# EAGLE design IrrigationManager (EAGLE 9.6.1)
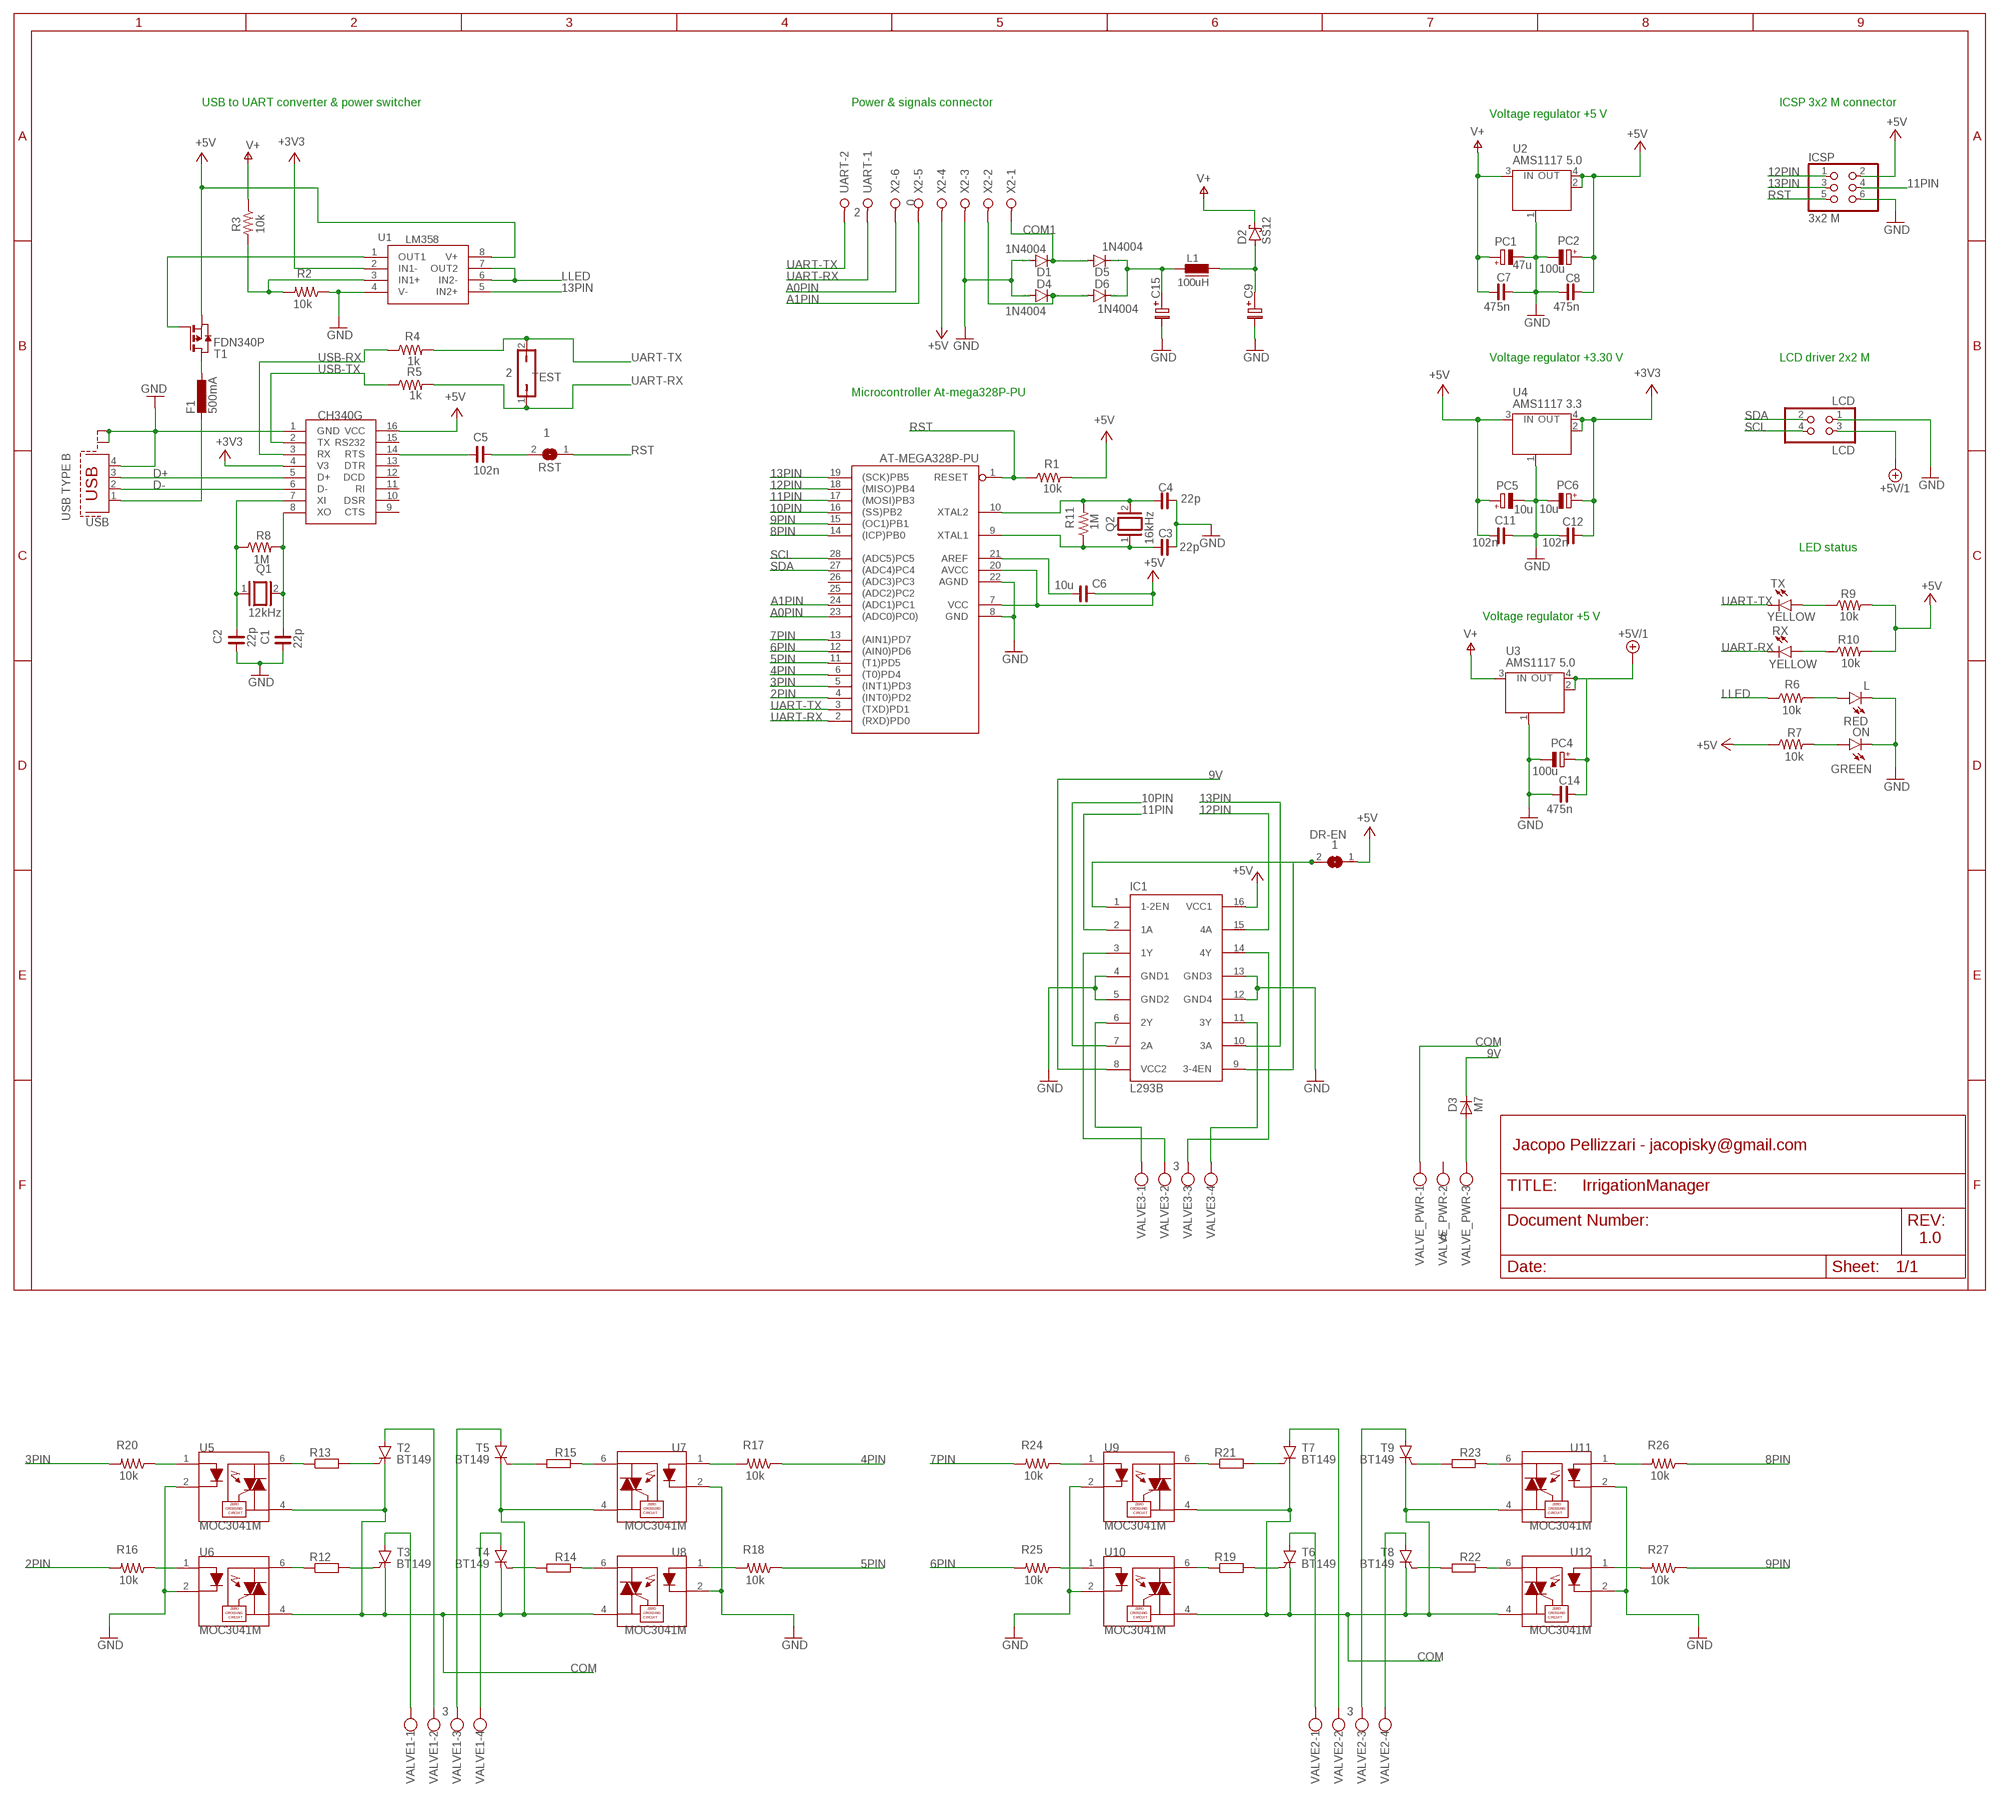
[diagram p0: schematic, sheet 1]

## Parts
AT-MEGA328P-PU  ATMEGA328P-PU  [DIL28-3]
C1  22p  C_1206  [C1206]
C2  22p  C_1206  [C1206]
C3  22p  C_1206  [C1206]
C4  22p  C_1206  [C1206]
C5  102n  C_1206  [C1206]
C6  10u  C_1206  [C1206]
C7  475n  C_1206  [C1206]
C8  475n  C_1206  [C1206]
C9  C-PR-5,0X10  [E5,0-10]
C11  102n  C_1206  [C1206]
C12  102n  C_1206  [C1206]
C14  475n  C_1206  [C1206]
C15  C-PR-5,0X10  [E5,0-10]
D1  1N4004  [DO41-10]
D2  SS12  [SMA]
D3  M7  DIODE-SMB  [SMB]
D4  1N4004  [DO41-10]
D5  1N4004  [DO41-10]
D6  1N4004  [DO41-10]
DR-EN  1  SJ  [SJ]
F1  500mA  L-EUL1812  [L1812]
IC1  L293B  L293D  [DIL16]
ICSP  3x2 M  PINHD-2X3  [2X03]
L  RED  LEDCHIPLED_1206  [CHIPLED_1206]
L1  100uH  07HCP-4U7  [FASTRON_07HCP_INDUCTOR]
LCD  LCD  PINHD-2X2  [2X02]
ON  GREEN  LEDCHIPLED_1206  [CHIPLED_1206]
PC1  47u  CPOL-EUD  [PANASONIC_D]
PC2  100u  CPOL-EUD  [PANASONIC_D]
PC4  100u  CPOL-EUD  [PANASONIC_D]
PC5  10u  CPOL-EU153CLV-0405  [153CLV-0405]
PC6  10u  CPOL-EU153CLV-0405  [153CLV-0405]
Q1  12kHz  XTAL/S  [QS]
Q2  16kHz  XTAL/S  [QS]
R1  10k  ERJ-8GEY0R00V  [RES_1206]
R2  10k  ERJ-8GEY0R00V  [RES_1206]
R3  10k  ERJ-8GEY0R00V  [RES_1206]
R4  1k  ERJ-8GEY0R00V  [RES_1206]
R5  1k  ERJ-8GEY0R00V  [RES_1206]
R6  10k  ERJ-8GEY0R00V  [RES_1206]
R7  10k  ERJ-8GEY0R00V  [RES_1206]
R8  1M  ERJ-8GEY0R00V  [RES_1206]
R9  10k  ERJ-8GEY0R00V  [RES_1206]
R10  10k  ERJ-8GEY0R00V  [RES_1206]
R11  1M  ERJ-8GEY0R00V  [RES_1206]
R12  R-EU_0204/7  [0204/7]
R13  R-EU_0204/7  [0204/7]
R14  R-EU_0204/7  [0204/7]
R15  R-EU_0204/7  [0204/7]
R16  10k  ERJ-8GEY0R00V  [RES_1206]
R17  10k  ERJ-8GEY0R00V  [RES_1206]
R18  10k  ERJ-8GEY0R00V  [RES_1206]
R19  R-EU_0204/7  [0204/7]
R20  10k  ERJ-8GEY0R00V  [RES_1206]
R21  R-EU_0204/7  [0204/7]
R22  R-EU_0204/7  [0204/7]
R23  R-EU_0204/7  [0204/7]
R24  10k  ERJ-8GEY0R00V  [RES_1206]
R25  10k  ERJ-8GEY0R00V  [RES_1206]
R26  10k  ERJ-8GEY0R00V  [RES_1206]
R27  10k  ERJ-8GEY0R00V  [RES_1206]
RST  1  SJ  [SJ]
RX  YELLOW  LEDCHIPLED_1206  [CHIPLED_1206]
T1  FDN340P  PMOSSOT23  [SOT-23]
T2  BT149  [TO92-4]
T3  BT149  [TO92-4]
T4  BT149  [TO92-4]
T5  BT149  [TO92-4]
T6  BT149  [TO92-4]
T7  BT149  [TO92-4]
T8  BT149  [TO92-4]
T9  BT149  [TO92-4]
TEST  2  JP1Q  [JP1]
TX  YELLOW  LEDCHIPLED_1206  [CHIPLED_1206]
U1  LM358  LM358DR  [LM358DR]
U2  AMS1117 5.0  MC33269ST-3.3T3  [SOT223]
U3  AMS1117 5.0  MC33269ST-3.3T3  [SOT223]
U4  AMS1117 3.3  MC33269ST-3.3T3  [SOT223]
U5  MOC3041M  [DIP762W46P254L889H508Q6]
U6  MOC3041M  [DIP762W46P254L889H508Q6]
U7  MOC3041M  [DIP762W46P254L889H508Q6]
U8  MOC3041M  [DIP762W46P254L889H508Q6]
U9  MOC3041M  [DIP762W46P254L889H508Q6]
U10  MOC3041M  [DIP762W46P254L889H508Q6]
U11  MOC3041M  [DIP762W46P254L889H508Q6]
U12  MOC3041M  [DIP762W46P254L889H508Q6]
U$1  CH340G  [SOIC16]
UART  2  W237-02P  [W237-132]
USB  USB TYPE B  PN61729-S  [PN61729-S]
VALVE1  3  W237-04P  [W237-4P]
VALVE2  3  W237-04P  [W237-4P]
VALVE3  3  W237-04P  [W237-4P]
VALVE_PWR  6  W237-03P  [W237-133]
X2  0  W237-06P  [W237-6P]

## Nets
2PIN: AT-MEGA328P-PU.4((INT0)PD2) R16.2
3PIN: AT-MEGA328P-PU.5((INT1)PD3) R20.2
4PIN: AT-MEGA328P-PU.6((T0)PD4) R17.1
5PIN: AT-MEGA328P-PU.11((T1)PD5) R18.1
5VP: T1.3(G) U1.1(OUT1)
6PIN: AT-MEGA328P-PU.12((AIN0)PD6) R25.2
7PIN: AT-MEGA328P-PU.13((AIN1)PD7) R24.2
8PIN: AT-MEGA328P-PU.14((ICP)PB0) R26.1
9PIN: AT-MEGA328P-PU.15((OC1)PB1) R27.1
9V: D3.C IC1.8(VCC2)
10PIN: AT-MEGA328P-PU.16((SS)PB2) IC1.7(2A)
11PIN: AT-MEGA328P-PU.17((MOSI)PB3) IC1.2(1A) ICSP.4
12PIN: AT-MEGA328P-PU.18((MISO)PB4) IC1.15(4A) ICSP.1
13PIN: AT-MEGA328P-PU.19((SCK)PB5) IC1.10(3A) ICSP.3 U1.5(IN2+)
+3V3: C12.2 PC6.+ U1.2(IN1-) U4.2(OUT) U4.4(OUT) U$1.4(V3)
+5V: AT-MEGA328P-PU.7(VCC) AT-MEGA328P-PU.20(AVCC) C6.2 C8.2 C11.1 DR-EN.1 IC1.16(VCC1) ICSP.2 PC2.+ PC5.+ R1.2 R7.1 R9.2 R10.2 T1.2(S) U1.8(V+) U2.2(OUT) U2.4(OUT) U4.3(IN) U$1.16(VCC) X2.4
+5V/1: C14.2 LCD.3 PC4.+ U3.2(OUT) U3.4(OUT)
A0PIN: AT-MEGA328P-PU.23((ADC0)PC0)) X2.6
A1PIN: AT-MEGA328P-PU.24((ADC1)PC1) X2.5
COM: T2.C T3.C T4.C T5.C T6.C T7.C T8.C T9.C U5.4(MT1) U6.4(MT1) U7.4(MT1) U8.4(MT1) U9.4(MT1) U10.4(MT1) U11.4(MT1) U12.4(MT1) VALVE_PWR.1
COM1: D1.C D5.A X2.1
CRST: C5.1 U$1.14(RTS)
D+: U$1.5(D+) USB.3
D-: U$1.6(D-) USB.2
FUSE5V: F1.1 T1.1(D)
GND: AT-MEGA328P-PU.8(GND) AT-MEGA328P-PU.22(AGND) C1.1 C2.1 C3.2 C4.2 C7.2 C8.1 C9.- C11.2 C12.1 C14.1 C15.- D1.A D4.A IC1.4(GND1) IC1.5(GND2) IC1.12(GND4) IC1.13(GND3) ICSP.6 L.C LCD.1 ON.C PC1.- PC2.- PC4.- PC5.- PC6.- R2.1 U1.4(V-) U2.1(GND/ADJ) U3.1(GND/ADJ) U4.1(GND/ADJ) U5.2(C) U6.2(C) U7.2(C) U8.2(C) U9.2(C) U10.2(C) U11.2(C) U12.2(C) U$1.1(GND) USB.4 USB.S1 USB.S2 X2.3
HV10: IC1.6(2Y) VALVE3.1
HV11: IC1.3(1Y) VALVE3.2
HV12: IC1.14(4Y) VALVE3.3
HV13: IC1.11(3Y) VALVE3.4
LLED: R6.1 U1.6(IN2-) U1.7(OUT2)
N$1: D3.A VALVE_PWR.3
N$2: C1.2 Q1.2 R8.2 U$1.8(XO)
N$3: C2.2 Q1.1 R8.1 U$1.7(XI)
N$5: AT-MEGA328P-PU.9(XTAL1) C3.1 Q2.1 R11.1
N$6: AT-MEGA328P-PU.10(XTAL2) C4.1 Q2.2 R11.2
N$9: R12.2 T3.G
N$11: R12.1 U6.6(MT2)
N$12: R13.1 U5.6(MT2)
N$13: D4.C D6.A X2.2
N$14: R2.2 R3.2 U1.3(IN1+)
N$15: C15.+ D5.C D6.C L1.1
N$16: C5.2 RST.2
N$17: T2.A VALVE1.2
N$18: DR-EN.2 IC1.1(1-2EN) IC1.9(3-4EN)
N$19: C9.+ D2.A L1.2
N$20: T4.A VALVE1.4
N$21: R14.2 T4.G
N$22: R14.1 U8.6(MT2)
N$23: R15.1 U7.6(MT2)
N$25: R13.2 T2.G
N$26: R20.1 U5.1(A)
N$27: R15.2 T5.G
N$28: R16.1 U6.1(A)
N$29: T5.A VALVE1.3
N$30: R9.1 TX.A
N$31: R17.2 U7.1(A)
N$32: R18.2 U8.1(A)
N$33: T3.A VALVE1.1
N$35: T6.A VALVE2.1
N$36: R19.2 T6.G
N$37: R19.1 U10.6(MT2)
N$38: R21.1 U9.6(MT2)
N$40: R21.2 T7.G
N$41: T7.A VALVE2.2
N$42: T8.A VALVE2.4
N$43: R22.2 T8.G
N$44: R22.1 U12.6(MT2)
N$45: R23.1 U11.6(MT2)
N$46: R23.2 T9.G
N$47: T9.A VALVE2.3
N$48: R24.1 U9.1(A)
N$49: R25.1 U10.1(A)
N$50: R26.2 U11.1(A)
N$51: R10.1 RX.A
N$52: R27.2 U12.1(A)
N$54: AT-MEGA328P-PU.21(AREF) C6.1
P13LED: L.A R6.2
PWRLED: ON.A R7.2
RST: AT-MEGA328P-PU.1(RESET) ICSP.5 R1.1 RST.1
SCL: AT-MEGA328P-PU.28((ADC5)PC5) LCD.4
SDA: AT-MEGA328P-PU.27((ADC4)PC4) LCD.2
UART-RX: AT-MEGA328P-PU.2((RXD)PD0) R5.2 RX.C TEST.1 UART.1
UART-TX: AT-MEGA328P-PU.3((TXD)PD1) R4.2 TEST.2 TX.C UART.2
USB5V: F1.2 USB.1
USB-RX: R4.1 U$1.3(RX)
USB-TX: R5.1 U$1.2(TX)
V+: C7.1 D2.C PC1.+ R3.1 U2.3(IN) U3.3(IN)
Unconnected: AT-MEGA328P-PU.25((ADC2)PC2) AT-MEGA328P-PU.26((ADC3)PC3) U$1.9(CTS) U$1.10(DSR) U$1.11(RI) U$1.12(DCD) U$1.13(DTR) U$1.15(RS232) VALVE_PWR.2

## Notes on the sheet
- USB to UART converter & power switcher | Power & signals connector | ICSP 3x2 M connector
- Voltage regulator +5 V
- Voltage regulator +3.30 V | LCD driver 2x2 M
- Microcontroller At-mega328P-PU
- LED status
- Voltage regulator +5 V
- Jacopo Pellizzari - jacopisky@gmail.com
- 1.0

## Library data of the parts
AT-MEGA328P-PU = SmartPrj:ATMEGA328P-: MICROCONTROLLER 4 Kbytes FLASH 128 bytes SRAM 256 bytes EEPROM UART 6-channel 10 bit ADC
C1-C8 C11 C12 C14 = rc-master-smd:C_: NON-POLARIZED CAP
C9 C15 = cap-pan40:C-PR: POLARIZED ELECTROLYTIC/TANTALUM
D1 D4-D6 = diode:1N4004: DIODE general purpose rectifier, 1 A
D2 = Diodes:SS12: DIODE SCHOTTKY 20V 1A SMA Manufacturer's datasheet <https://www.onsemi.com/pub/Collateral/SS19-D.PDF>; CREATED_BY: PCBLayout.com; DIGIKEY_PART_NUMBER: SS12FSCT-ND; MANUFACTURER: ON Semiconductor; MPN: SS12; PACKAGE: SMA (DO-214AC)
D3 = Diode:DIODE-: DIODE
DR-EN RST = jumper:SJ: SMD solder JUMPER
F1 = rcl:L-EU: INDUCTOR, European symbol
IC1 = st-microelectronics:L293D: PUSH-PULL 4 CHANNEL DRIVER; MPN: L293D; OC_FARNELL: 9589619; OC_NEWARK: 56P8249
ICSP = SmartPrj:PINHD-2X3: PIN HEADER
L ON RX TX = led:LED: LED OSRAM: - CHIPLED LG R971, LG N971, LY N971, LG Q971, LY Q971, LO R971, LY R971 LH N974, LH R974 LS Q976, LO Q976, LY Q976 LO Q996 - Hyper CHIPLED LW Q18S LB Q993, LB Q99A, LB R99A - SideLED LS A670, LO A670, LY A670, LG A670, LP A670 LB A673, LV A673, LT A673, LW A673 LH A674 LY A675 LS A676, LA A676, LO A676, LY A676, LW A676 LS A679, LY A679, LG A679 - Hyper Micro SIDELED® LS Y876, LA Y876, LO Y876, LY Y876 LT Y87S - SmartLED LW L88C, LW L88S LB L89C, LB L89S, LG L890 LS L89K, LO L89K, LY L89K LS L896, LA L896, LO L896, LY L896 - TOPLED LS T670, LO T670, LY T670, LG T670, LP T670 LSG T670, LSP T670, LSY T670, LOP T670, LYG T670 LG T671, LOG T671, LSG T671 LB T673, LV T673, LT T673, LW T673 LH T674 LS T676, LA T676, LO T676, LY T676, LB T676, LH T676, LSB T676, LW T676 LB T67C, LV T67C, LT T67C, LS T67K, LO T67K, LY T67K, LW E67C LS E67B, LA E67B, LO E67B, LY E67B, LB E67C, LV E67C, LT E67C LW T67C LS T679, LY T679, LG T679 LS T770, LO T770, LY T770, LG T770, LP T770 LB T773, LV T773, LT T773, LW T773 LH T774 LS E675, LA E675, LY E675, LS T675 LS T776, LA T776, LO T776, LY T776, LB T776 LHGB T686 LT T68C, LB T68C - Hyper Mini TOPLED® LB M676 - Mini TOPLED Santana® LG M470 LS M47K, LO M47K, LY M47K Source: http://www.osram.convergy.de LUXEON: - LUMILED® LXK2-PW12-R00, LXK2-PW12-S00, LXK2-PW14-U00, LXK2-PW14-V00 LXK2-PM12-R00, LXK2-PM12-S00, LXK2-PM14-U00 LXK2-PE12-Q00, LXK2-PE12-R00, LXK2-PE12-S00, LXK2-PE14-T00, LXK2-PE14-U00 LXK2-PB12-K00, LXK2-PB12-L00, LXK2-PB12-M00, LXK2-PB14-N00, LXK2-PB14-P00, LXK2-PB14-Q00 LXK2-PR12-L00, LXK2-PR12-M00, LXK2-PR14-Q00, LXK2-PR14-R00 LXK2-PD12-Q00, LXK2-PD12-R00, LXK2-PD12-S00 LXK2-PH12-R00, LXK2-PH12-S00 LXK2-PL12-P00, LXK2-PL12-Q00, LXK2-PL12-R00 Source: www.luxeon.com KINGBRIGHT: KA-3528ASYC Source: www.kingbright.com
L1 = _fastron_07HCP:07HCP-*: Fastron 07 HCP Series Inductors (Ferrite Core) (1 … 10000)uH, THT vertical assembly, 5 mm grid / 8.3 mm max. diameter / 10 mm max. height RoHS-Compliant Source: www.fastrongroup.co Technologies: 07HCP-… L/uH RDCmax/Ω IN/A Isat/A 1R0 1 0.06 7.5 10 2R2 2.2 0.01 6 8 3R3 3.3 0.013 5 6.3 4R7 4.7 0.018 4 5.4 6R8 6.8 0.025 3.8 6.5 100 10 0.04 2.6 5 220 22 0.055 2.3 3.6 470 47 0.1 1.3 2.5 680 68 0.14 1.1 2.1 820 82 0.16 1 1.9 101 100 0.19 0.9 1.6 121 120 0.22 0.85 1 221 220 0.38 0.64 1.2 331 330 0.7 0.51 0.85 471 470 0.89 0.43 0.8 821 820 1.56 0.36 0.7 102 1000 1.84 0.3 0.5 182 1800 3.3 0.21 0.35 103 10000 24 0.14 0.17 ±10% / ±20% fL = 1 kHz | 0.25 V Author: Dipl.-Ing. FH Rainer Bayer HHN Hochschule Heilbronn, rainer.bayer@hs-heilbronn.de Ingenieurbüro ing-rb, mail@ing-rb.de; FASTRON#: 07HCP-4R7
LCD = SmartPrj:PINHD-2X2: PIN HEADER
PC1 PC2 PC4 = rcl:CPOL-EU: POLARIZED CAPACITOR, European symbol
PC5 PC6 = rcl:CPOL-EU: POLARIZED CAPACITOR, European symbol; SPICEPREFIX: C
Q1 Q2 = special:XTAL/S: CRYSTAL
R1-R11 R16-R18 R20 R24-R27 = Resistor_Capacitor:ERJ-8GEY0R00V: RES SMD 0 OHM JUMPER 1/4W 1206 Manufacturer's datasheet <https://industrial.panasonic.com/ww/products/resistors/chip-resistors/general-purpose-chip-resistors/thick-film-chip-resistors/ERJ8GEY0R00V>; CREATED_BY: PCBLayout.com; DIGIKEY_PART_NUMBER: P0.0ETR-ND; MANUFACTURER: Panasonic Electronic Components; MPN: ERJ-8GEY0R00V; PACKAGE: SMD 1206
R12-R15 R19 R21-R23 = rcl:R-EU_: RESISTOR, European symbol; SPICEPREFIX: R
T1 = zetex:PMOSSOT23: MOS FET; OC_FARNELL: unknown; OC_NEWARK: unknown
T2-T9 = triac:BT149: THYRISTOR
TEST = jumper:JP1Q: JUMPER
U1 = IC:LM358DR: IC OPAMP GP 2 CIRCUIT 8SOIC Manufacturer's datasheet <http://www.ti.com/lit/ds/symlink/lm358.pdf>; CREATED_BY: PCBLayout.com; DIGIKEY_PART_NUMBER: 296-1014-1-ND; MANUFACTURER: Texas Instruments; MPN: LM358DR; PACKAGE: 8-SOIC
U2-U4 = linear:MC33269ST*: Adjustable Output Low Dropout Voltage Regulator 800 mA Source: http://www.onsemi.com/pub/Collateral/MC33269-D.PDF
U5-U12 = MOC3041M:MOC3041M: Triac Output Optocoupler, Zero Cross, Zero Crossing, 7.5 kV, 400 V, DIP, 6 Check prices <https://pricing.snapeda.com/parts/MOC3041M/ON%20Semiconductor/view-part?ref=eda>; AVAILABILITY: Good; DESCRIPTION: Optoisolator Triac Output 4170Vrms 1 Channel 6-DIP; MF: ON Semiconductor; MP: MOC3041M; PACKAGE: PDIP-6 ON Semiconductor; PRICE: None; PURCHASE-URL: https://pricing.snapeda.com/search/part/MOC3041M/?ref=eda
U$1 = ch340g:CH340G
UART = con-wago-508:W237-02P: WAGO SREW CLAMP; OC_FARNELL: unknown; OC_NEWARK: unknown
USB = con-berg:PN61729-S: BERG USB connector; OC_FARNELL: unknown; OC_NEWARK: unknown
VALVE1-VALVE3 = con-wago-508:W237-04P: WAGO SREW CLAMP
VALVE_PWR = con-wago-508:W237-03P: WAGO SREW CLAMP
X2 = con-wago-508:W237-06P: WAGO SREW CLAMP; OC_FARNELL: unknown; OC_NEWARK: unknown

## Board
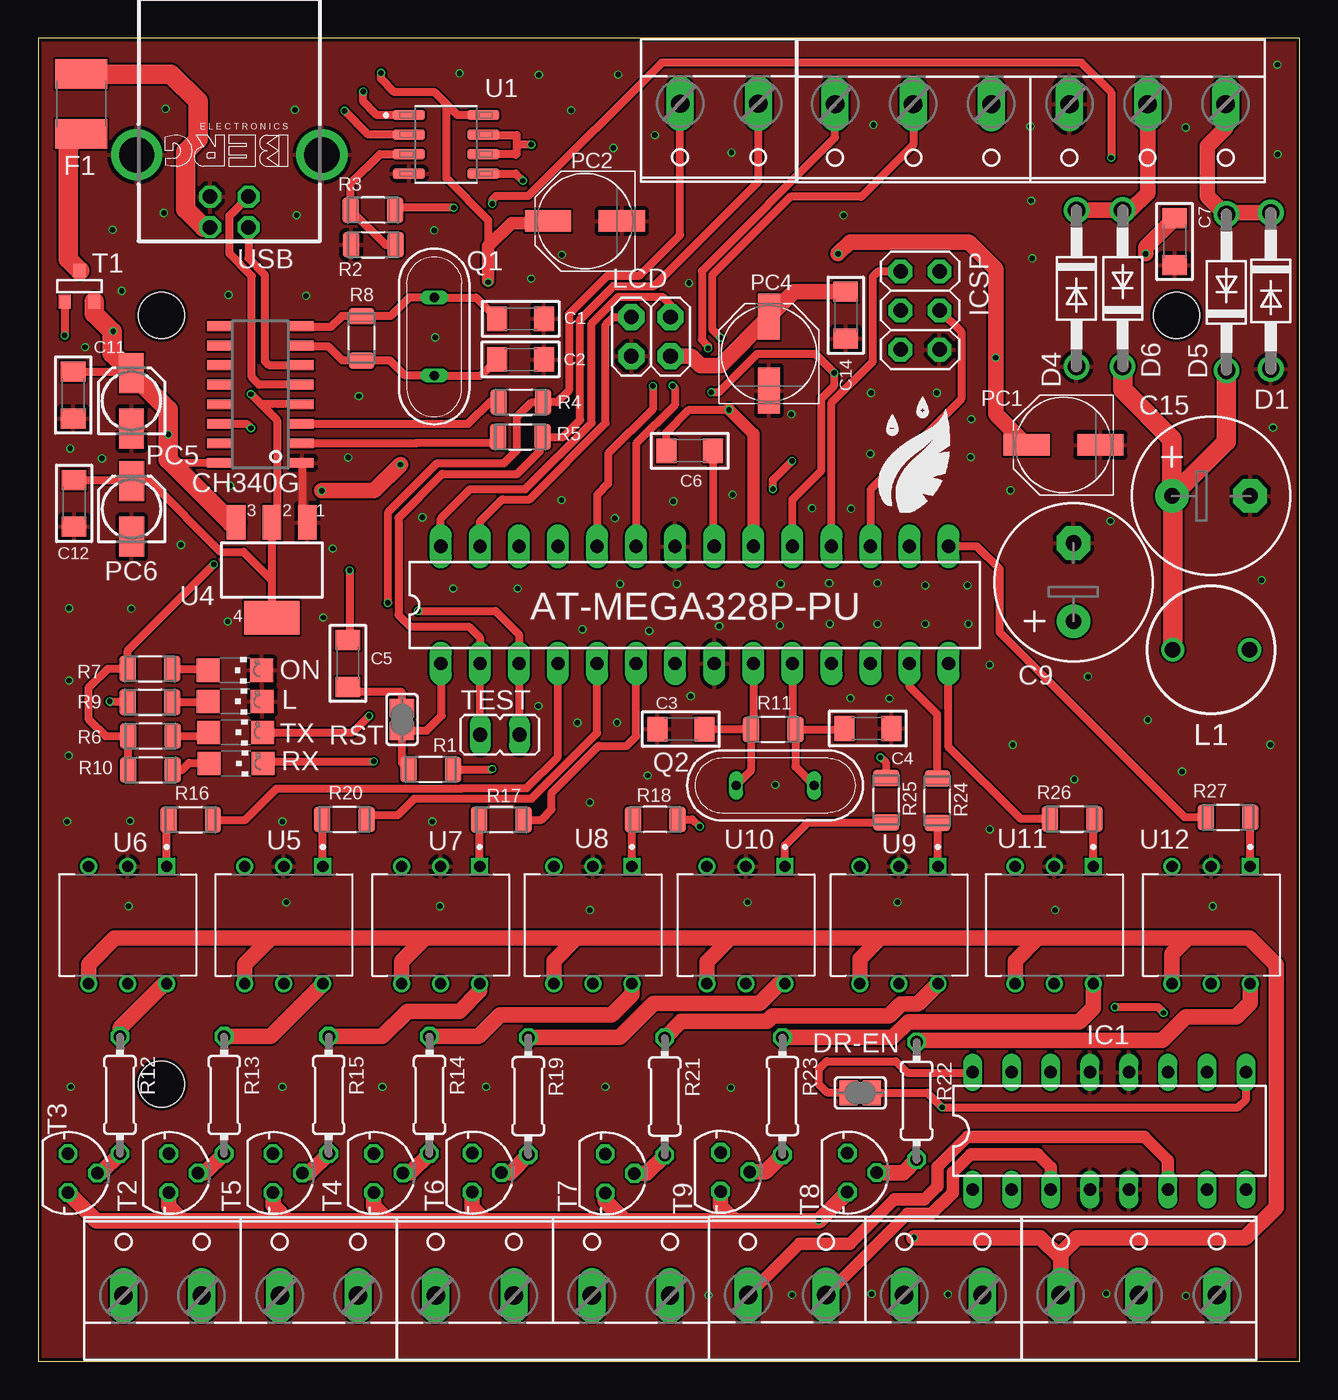
[diagram p1: board, top side]
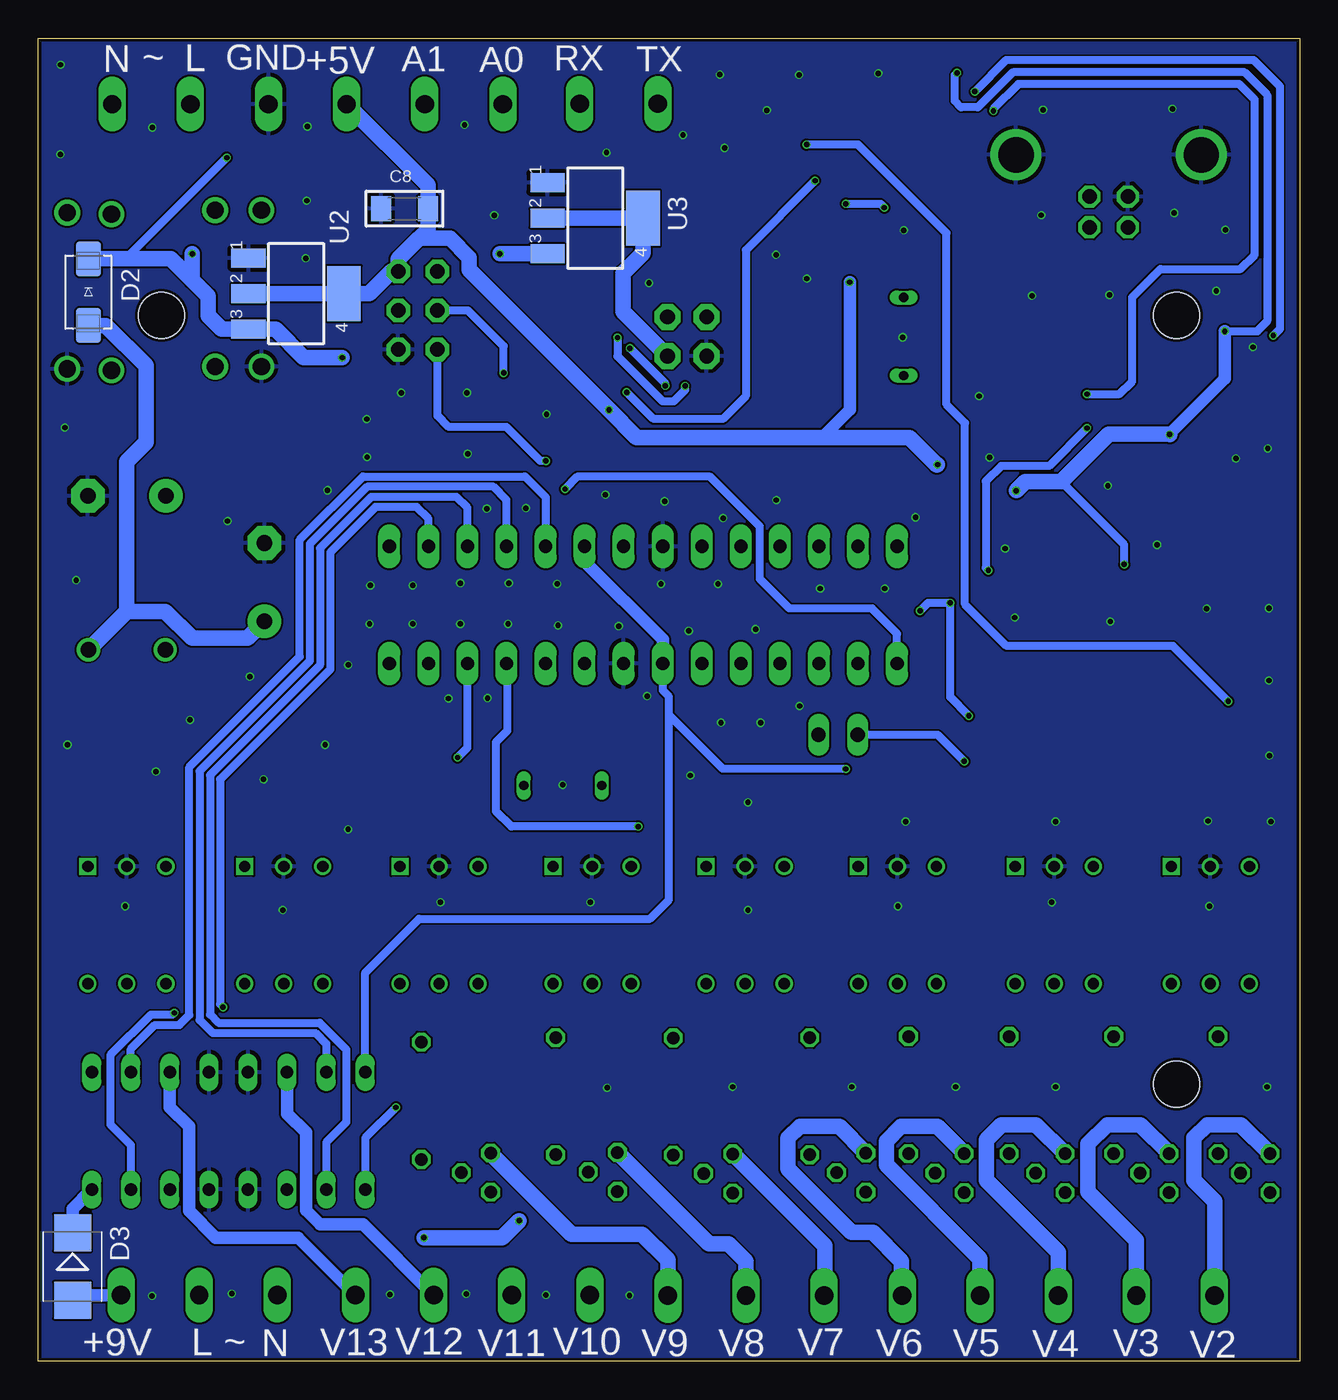
[diagram p2: board, bottom side, seen from below]

Size 82 x 86 mm. Coordinates in mm from the lower left corner, seen from the top.
Outline: 0,0 82,0 82,86 0,86 0,0
Copper layers (1*16): Top 0.035559375mm / dielectric 1.6mm / Bottom 0.035559375mm
Design rules "jlcpcb2layer": minimum track width 5mil, minimum drill 12mil, track to track 5mil, track to pad 5mil, pad to pad 5mil, via to via 5mil, smd to smd 5mil, copper to edge 8mil, drill to drill 6mil, minimum pad ring 5mil, minimum via ring 3mil, stop-mask expansion 2.5mil, vias tented up to drill 0mil, thermal gap 10mil
Holes 3 mm at 8,18 74,68 8,68

### Footprints (pad centres in the part's own frame; a part is rotated, then mirrored left to right if it is on the bottom)
DIL28-3 = drill 0.85 pad 1.422 long: 1 -16.51,-3.81; 2 -13.97,-3.81; 3 -11.43,-3.81; 4 -8.89,-3.81; 5 -6.35,-3.81; 6 -3.81,-3.81; 7 -1.27,-3.81; 8 1.27,-3.81; 9 3.81,-3.81; 10 6.35,-3.81; 11 8.89,-3.81; 12 11.43,-3.81; 13 13.97,-3.81; 14 16.51,-3.81; 15 16.51,3.81; 16 13.97,3.81; 17 11.43,3.81; 18 8.89,3.81; 19 6.35,3.81; 20 3.81,3.81; 21 1.27,3.81; 22 -1.27,3.81; 23 -3.81,3.81; 24 -6.35,3.81; 25 -8.89,3.81; 26 -11.43,3.81; 27 -13.97,3.81; 28 -16.51,3.81
C1206 = smd 1.3 x 1.6: 1 -1.524,0; 2 1.524,0
E5,0-10 = drill 1.016 pad 2.184: + -2.54,0 | drill 1.016 pad 2.184 octagon: - 2.54,0
DO41-10 = drill 1.118: A 5.08,0; C -5.08,0
SMA = smd 2.28 x 1.66: A 2.165,0; C -2.165,0
SMB = smd 2.4 x 2.4: A 2.2,0; C -2.2,0
SJ = smd 1.168 x 1.6: 1 -0.762,0; 2 0.762,0
L1812 = smd 1.9 x 3.4: 1 -1.95,0; 2 1.95,0
DIL16 = drill 0.813 long: 1 -8.89,-3.81; 2 -6.35,-3.81; 3 -3.81,-3.81; 4 -1.27,-3.81; 5 1.27,-3.81; 6 3.81,-3.81; 7 6.35,-3.81; 8 8.89,-3.81; 9 8.89,3.81; 10 6.35,3.81; 11 3.81,3.81; 12 1.27,3.81; 13 -1.27,3.81; 14 -3.81,3.81; 15 -6.35,3.81; 16 -8.89,3.81
2X03 = drill 0.95 pad 1.55 octagon: 1 -2.54,-1.27; 2 -2.54,1.27; 3 0,-1.27; 4 0,1.27; 5 2.54,-1.27; 6 2.54,1.27
CHIPLED_1206 = smd 1.5 x 1.5: A 0,-1.75; C 0,1.75
FASTRON_07HCP_INDUCTOR = drill 1: 1 -2.5,0; 2 2.5,0
2X02 = drill 0.95 pad 1.676 octagon: 1 -1.27,-1.27; 2 -1.27,1.27; 3 1.27,-1.27; 4 1.27,1.27
PANASONIC_D = smd 3 x 1.4: + 2.4,0; - -2.4,0
153CLV-0405 = smd 2.6 x 1.6: + 1.8,0; - -1.8,0
QS = drill 0.61 long: 1 -2.54,0; 2 2.54,0
RES_1206 = smd 1.08 x 1.68: 1 -1.445,0; 2 1.445,0
0204/7 = drill 0.813 octagon: 1 -3.81,0; 2 3.81,0
SOT-23 = smd 0.787 x 0.889: 1 0.025,-1.016; 2 -0.94,1.016; 3 0.991,1.016
TO92-4 = drill 0.813 octagon: A -1.27,0; C 1.27,0; G 0,1.905
JP1 = drill 0.914 long: 1 0,-1.27; 2 0,1.27
LM358DR = smd 0.66 x 2.07: 1 -1.905,-2.42; 2 -0.635,-2.42; 3 0.635,-2.42; 4 1.905,-2.42; 5 1.905,2.42; 6 0.635,2.42; 7 -0.635,2.42; 8 -1.905,2.42
SOT223 = smd 1.219 x 2.235: 1 -2.311,-3.099; 2 0,-3.099; 3 2.311,-3.099 | smd 3.6 x 2.2: 4 0,3.099
DIP762W46P254L889H508Q6 = drill 0.74 square: 1 -3.81,2.54 | drill 0.74: 2 -3.81,0; 3 -3.81,-2.54; 4 3.81,-2.54; 5 3.81,0; 6 3.81,2.54
SOIC16 = smd 0.635 x 1.524: 1 -4.445,-2.695; 2 -3.175,-2.695; 3 -1.905,-2.695; 4 -0.635,-2.695; 5 0.635,-2.695; 6 1.905,-2.695; 7 3.175,-2.695; 8 4.445,-2.695; 9 4.445,2.695; 10 3.175,2.695; 11 1.905,2.695; 12 0.635,2.695; 13 -0.635,2.695; 14 -1.905,2.695; 15 -3.175,2.695; 16 -4.445,2.695
W237-132 = drill 1.194 long: 1 -2.54,-0.635; 2 2.54,-0.635
PN61729-S = drill 0.95 octagon: 1 1.25,4.71; 2 -1.25,4.71; 3 -1.25,2.71; 4 1.25,2.71 | drill 2.3 pad 2.9: S1 -6.02,0; S2 6.02,0
W237-4P = drill 1.194 long: 1 -7.62,-0.635; 2 -2.54,-0.635; 3 2.54,-0.635; 4 7.62,-0.635
W237-133 = drill 1.194 long: 1 -5.08,-0.635; 2 0,-0.635; 3 5.08,-0.635
W237-6P = drill 1.194 long: 1 -12.7,-0.635; 2 -7.62,-0.635; 3 -2.54,-0.635; 4 2.54,-0.635; 5 7.62,-0.635; 6 12.7,-0.635

### Placement (x,y rotation side)
AT-MEGA328P-PU  42.67,49.17 0 top
C1  31.36,67.77 180 top
C2  31.35,65.13 180 top
C3  41.78,41.09 180 top
C4  53.93,41.13 0 top
C5  20.12,45.36 270 top
C6  42.35,59.19 180 top
C7  73.88,72.79 270 top
C8  58.2,74.93 0 bottom
C9  67.3,50.65 90 top
C11  2.26,62.82 270 top
C12  2.32,55.77 90 top
C14  52.5,68 90 top
C15  76.25,56.25 0 top
D1  80.13,69.59 270 top
D2  78.75,69.5 270 bottom
D3  79.78,6.15 270 bottom
D4  67.5,69.75 270 top
D5  77.25,69.5 90 top
D6  70.5,69.75 90 top
DR-EN  53.44,17.44 0 top
F1  2.78,81.74 90 top
IC1  69.64,14.96 0 top
ICSP  57.33,68.32 270 top
L  12.79,42.9 270 top
L1  76.25,46.25 0 top
LCD  39.83,66.62 0 top
ON  12.78,44.92 270 top
PC1  66.65,59.57 180 top
PC2  35.53,74.12 180 top
PC4  47.5,65.5 90 top
PC5  6.06,62.43 90 top
PC6  6.07,55.4 90 top
Q1  25.73,66.62 90 top
Q2  47.9,37.43 0 top
R1  25.51,38.47 0 top
R2  21.76,72.59 0 top
R3  21.76,74.84 180 top
R4  31.36,62.34 0 top
R5  31.34,60.09 0 top
R6  7.26,42.84 0 top
R7  7.26,45.01 0 top
R8  21.01,66.51 90 top
R9  7.29,40.64 180 top
R10  7.29,38.43 180 top
R11  47.77,41.07 0 top
R12  5.3,17.3 270 top
R13  12.07,17.3 270 top
R14  25.43,17.3 270 top
R15  18.88,17.3 270 top
R16  9.9,35.2 0 top
R17  30.1,35.2 180 top
R18  40.1,35.23 180 top
R19  31.85,17.23 270 top
R20  19.9,35.23 0 top
R21  40.73,17.2 270 top
R22  57.1,16.93 270 top
R23  48.38,17.23 270 top
R24  58.45,36.42 90 top
R25  55.12,36.48 90 top
R26  67.2,35.25 0 top
R27  77.35,35.35 0 top
RST  23.64,41.72 90 top
RX  12.86,38.86 270 top
T1  2.69,69.9 180 top
T2  8.47,12.22 270 top
T3  1.93,12.22 270 top
T4  21.8,12.22 270 top
T5  15.25,12.22 270 top
T6  28.2,12.25 270 top
T7  36.85,12.2 270 top
T8  52.6,12.25 270 top
T9  44.35,12.3 270 top
TEST  30,40.72 270 top
TX  12.82,40.88 270 top
U1  26.51,79.12 270 top
U2  65.24,69.4 270 bottom
U3  45.8,74.31 270 bottom
U4  15.17,51.43 180 top
U5  15.95,28.35 270 top
U6  5.8,28.35 270 top
U7  26.15,28.35 270 top
U8  36.05,28.35 270 top
U9  55.95,28.35 270 top
U10  46,28.35 270 top
U11  66.05,28.35 270 top
U12  76.25,28.35 270 top
U$1  14.44,62.85 90 top
UART  44.26,81.12 180 top
USB  12.41,78.43 180 top
VALVE1  13.15,4.9 0 top
VALVE2  33.45,4.9 0 top
VALVE3  53.76,4.92 0 top
VALVE_PWR  71.55,4.93 0 top
X2  64.5,81.09 180 top

### Tracks (layer width: path | path; a pad name or v marks a point on that pad's centre or on a via)
2PIN
  Top 0.508: AT-MEGA328P-PU.4 33.78,39.28 31.75,37.25 27.54,37.25 27.51,37.23 15.48,37.23 13.45,35.2 R16.2
3PIN
  Top 0.508: R20.2 21.62,35.5 23.38,35.5 24.44,36.57 32.07,36.57 36.32,40.82 AT-MEGA328P-PU.5
4PIN
  Top 0.508: R17.1 32.7,35.2 33.38,35.88 33.38,36.94 36.43,40 38.25,40 38.86,40.61 AT-MEGA328P-PU.6
5PIN  (via drill 0.35)
  Top 0.508: R18.1 42.52,35.23 v43,34.75
  Bottom 0.508: v43,34.75 51.25,34.75 52.25,35.75 52.25,40.25 51.5,41 51.5,45.29 AT-MEGA328P-PU.11
5VP  (via drill 0.35)
  Top 0.508: T1.3 v1.7,66.68 | U1.1 22,81.02 21.12,81.91 v21.12,82.55
  Bottom 0.508: v1.7,66.68 1.28,67.11 1.28,82.88 2.98,84.58 19.08,84.58 v21.12,82.55
6PIN  (via drill 0.35)
  Top 0.508: R25.2 55.12,38.88 v54.75,39.25
  Bottom 0.508: v54.75,39.25 54.1,39.9 AT-MEGA328P-PU.12
7PIN
  Top 0.508: R24.2 58.45,42.05 56.64,43.86 AT-MEGA328P-PU.13
8PIN
  Top 0.508: R26.1 63.88,35.25 59.18,39.94 AT-MEGA328P-PU.14
9PIN
  Top 0.508: R27.1 74.53,35.35 62.5,47.38 62.5,51.5 61.02,52.98 AT-MEGA328P-PU.15
9V
  Bottom 0.813: D3.C 79.78,9.9 IC1.8
10PIN  (via drill 0.35)
  Top 0.508: v70,23.01 72.79,23.01 v73.16,22.64
  Bottom 0.508: AT-MEGA328P-PU.16 56.64,54.77 57.41,55.53 60.08,55.53 63.03,52.58 63.03,44.98 70.18,37.82 70.18,23.2 v70,23.01 | v73.16,22.64 73.29,22.52 74.7,22.52 77.32,19.9 77.32,15.39 75.99,14.06 IC1.7
11PIN
  Top 0.508: ICSP.4 58.62,68.31 60,66.94 60,62.56 54.1,56.66 AT-MEGA328P-PU.17
  Bottom 0.508: AT-MEGA328P-PU.17 54.1,55.49 54.81,56.19 60.35,56.19 63.69,52.86 63.69,45.25 70.84,38.09 70.84,22.53 70.31,21.99 63.71,21.99 61.98,20.27 61.98,15.53 63.29,14.22 IC1.2
12PIN
  Top 0.508: AT-MEGA328P-PU.18 51.56,62.31 54.25,65 54.25,70.5 54.6,70.86 ICSP.1
  Bottom 0.508: AT-MEGA328P-PU.18 51.56,56 52.42,56.85 60.63,56.85 64.35,53.13 64.35,45.52 71.52,38.35 71.52,22.18 70.67,21.33 63.98,21.33 63.29,20.64 IC1.15
13PIN  (via drill 0.35)
  Top 0.508: AT-MEGA328P-PU.19 49.02,56.02 50.9,57.9 50.9,62.59 51.75,63.43 v51.75,64.25 50.5,65.5 46.75,65.5 44.25,63 v43.75,63 | U1.5 31.04,77.21 v31.5,76.75
  Bottom 0.508: IC1.10 75.99,20.29 74.43,21.86 72.84,21.86 72.19,22.5 72.19,38.62 65.01,45.8 65.01,53.4 60.9,57.52 50.37,57.52 49.02,56.17 AT-MEGA328P-PU.19 | v51.75,64.25 51.75,66 54.06,68.31 ICSP.3 | v31.5,76.75 36,72.25 36,62.75 37.5,61.25 42,61.25 v43.75,63
+3V3  (via drill 0.35)
  Top 0.508: U$1.4 14.48,62.22 v13.82,62.87 15.52,61.17 15.52,54.87 U4.2 15.17,50.79 | 15.17,50.79 U4.4 | C12.2 5.97,57.3 PC6.+ 7.27,57.2 11.86,52.62 13.35,52.62 15.17,50.79 | U1.2 21.45,79.75 v19.9,81.3
  Bottom 0.508: v13.82,62.87 11.71,62.87 10.88,63.7 10.88,69.17 9.04,71 3.83,71 2.92,71.92 2.92,82.02 3.93,83.03 18.29,83.03 19.9,81.42 v19.9,81.3
+5V  (via drill 0.35)
  Top 0.508: U1.8 27.24,81.02 26.55,81.72 | v22.27,83.77 22.27,83.37 23.13,82.51 25.75,82.51 26.55,81.72 | C11.1 5.95,64.34 PC5.+ | 26.55,81.72 26.55,76.92 26.52,76.9 29.25,74.18 29.25,70.25 v29.25,70.15 | U$1.16 8.67,58.41 8.44,58.63 | C6.2 40.83,60.37 42.31,61.85 v44.9,61.85 | R10.2 R9.2 4.36,40.64 3.25,41.75 3.25,43.75 4.51,45.01 R7.1 5.82,46.22 v11.4,51.8 | DR-EN.1 51.31,17.44 50.75,18 50.75,19 51.25,19.5 55.75,19.5 56.5,18.75 60.73,18.75 IC1.16 | R1.2 29.48,38.48 v29.5,38.5
  Top 0.813: v44.9,61.85 46.48,60.27 AT-MEGA328P-PU.20 | PC2.+ 33.01,74 30.75,74 29.25,72.5 29.25,70.25
  Top 1.016: v18.43,56.59 21.83,56.59 v23.54,58.29
  Top 1.27: T1.2 3.63,68.1 4.79,66.94 4.79,65.5 PC5.+ 8.44,61.85 v8.44,60.25 8.44,58.63 12.55,54.53 U4.3
  Bottom 0.508: v4.86,66.96 v4.86,66.97 2.74,66.97 2.1,67.61 2.1,82.33 3.57,83.8 18.64,83.8 20.93,81.52 22,81.52 22.42,81.94 22.42,83.61 v22.27,83.77 | v11.4,51.8 11.4,53.09 15.49,57.18 | IC1.16 60.75,25.25 57.25,28.75 42.25,28.75 41,30 41,42 | AT-MEGA328P-PU.7 41.4,43.61 41,43.2 41,42 | v29.5,38.5 37.5,38.5 41,42
  Bottom 0.813: v29.25,70.15 29.25,61.86 31.05,60.06 | AT-MEGA328P-PU.7 41.4,46.9 46.48,51.98 AT-MEGA328P-PU.20 | v4.86,66.96 4.86,63.87 8.46,60.27
  Bottom 1.016: v23.54,58.29 23.57,58.26 25.38,60.06 31.05,60.06 43.11,60.06 v44.9,61.85 54,70.95 54,71.75 55.25,73 57.25,73 | v18.43,56.59 17.83,57.18 15.49,57.18 12.4,60.27 8.46,60.27 v8.44,60.25 | U2.2 U2.4 60.5,69.4 59.05,70.86 ICSP.2 58.6,71.65 57.25,73 | 57.25,73 56.68,73.57 C8.2 56.68,76.44 X2.4
+5V/1
  Top 1.016: LCD.3 42.45,65.34 43.06,64.73 44.33,64.73 PC4.+ 49.12,69.52 C14.2
  Bottom 1.016: U3.2 U3.4 42.7,72.05 44,70.75 44,68.25 LCD.3
A0PIN  (via drill 0.35)
  Top 0.508: AT-MEGA328P-PU.23 38.86,59.65 41.39,62.17 41.39,63.27 v41.24,63.42 | v43.55,65.85 43.55,66 43.13,66.42 43.13,70.88 51.8,79.55 X2.6
  Bottom 0.508: v43.55,65.85 41.24,63.54 v41.24,63.42
A1PIN  (via drill 0.35)
  Top 0.508: X2.5 56.88,79.08 53.5,75.7 48.88,75.7 43.8,70.62 43.8,67.1 v44.35,66.55 | v39.95,63.4 39.95,61.9 37.05,59 37.05,57.05 36.32,56.32 AT-MEGA328P-PU.24
  Bottom 0.508: v39.95,63.4 39.95,63.15 40.69,62.41 41.42,62.41 44.35,65.34 v44.35,66.55
COM  (via drill 0.35)
  Top 1.016: T3.C 3.75,9.12 9.38,9.12 | T2.C 8.47,10.03 9.38,9.12 | 9.38,9.12 16.25,9.12 | 16.25,9.12 22.75,9.12 | T5.C 15.25,10.12 16.25,9.12 | T4.C 21.8,10.07 22.75,9.12 | U6.4 3.26,25.79 4.97,27.5 15.12,27.5 | 15.12,27.5 25.12,27.5 | 25.12,27.5 35,27.5 | 35,27.5 45,27.5 | 45,27.5 54.75,27.5 | 54.75,27.5 65,27.5 | 65,27.5 74.75,27.5 | 15.12,27.5 13.41,25.79 U5.4 | U7.4 23.61,25.98 25.12,27.5 | U8.4 33.51,26.01 35,27.5 | 22.75,9.12 29.04,9.12 | 29.04,9.12 38.13,9.12 | 38.13,9.12 45.25,9.12 | 45.25,9.12 v50.74,9.12 T8.C | v56.93,8.03 65.16,8.03 66.47,6.71 VALVE_PWR.1 66.47,6.96 67.51,8 78.48,8 80.48,10 80.48,25.75 78.73,27.5 74.75,27.5 | 38.13,9.12 36.85,10.41 T7.C | T6.C 28.2,9.96 29.04,9.12 | T9.C 44.35,10.03 45.25,9.12 | U10.4 43.46,25.96 45,27.5 | U9.4 53.41,26.16 54.75,27.5 | U11.4 63.51,26.01 65,27.5 | U12.4 73.71,26.46 74.75,27.5
  Bottom 1.016: v56.93,8.03 51.84,8.03 v50.74,9.12
COM1
  Top 1.016: D5.A 77.34,74.67 | 77.34,74.67 D1.C | X2.1 77.2,80.2 76,79 76,75.75 77.08,74.67 77.34,74.67
CRST  (via drill 0.35)
  Top 0.508: U$1.14 13.54,60.95 v13.82,60.67 | v20.23,51.41 20.23,46.99 C5.1
  Bottom 0.508: v13.82,60.67 16.27,58.21 19.4,58.21 20.4,57.21 20.4,51.58 v20.23,51.41
D+
  Top 0.508: U$1.5 14.37,63.48 13.87,63.99 13.87,70.56 12.43,72 12.43,74.49 USB.3
D-
  Top 0.508: USB.2 13.66,71.7 14.72,70.64 14.72,65.02 14.98,64.76 U$1.6
FUSE5V
  Top 1.27: F1.1 1.94,78.95 1.94,71.65 T1.1
GND  (via drill 0.35)
  Top 0.508: U$1.1 17.13,54.88 U4.1
  other vias: 40.09,79.72 74.6,80.21 80.57,78.46 80.56,84.29 54.29,80.38 64.51,80.28 72.14,41.69 8.15,74.65 69.43,4.38 74.61,4.23 20.83,62.75 25.8,66.56 8.26,81.42 16.67,81.36 16.79,74.51 2.07,59.34 4.13,58.69 27.39,83.73 47.91,37.46 1.99,48.95 9.26,53.08 12.3,48.09 45.13,56.34 64.62,71.71 79.54,50.77 37.48,54.8 42.3,70.1 37.69,83.65 45.06,78.58 64.56,75.45 34.02,55.98 19.14,52.83 5.41,69.59 52.36,74.5 54.14,62.95 48.96,61.57 45.02,17.77 43.57,4.27 49.01,4.3 54.18,4.37 59.14,4.33 4.82,73.56 3.03,65.93 12.36,69.32 6.04,48.92 32.51,42.59 35.04,41.51 37.62,41.52 52.8,43.1 55.34,43.08 50.3,55.45 52.84,55.42 54.09,58.99 60.63,58.78 20.15,58.75 58.41,62.95 80.28,60.69 69.71,54.62 68.25,44.5 61.85,45.27 12.46,56.92 18.52,48.34 60.65,61.25 36.86,17.83 32.54,83.63 34.64,81.33 25.74,73.53 37.39,78.88 32.04,70.38 34.04,71.93 1.99,44.25 26.97,50.23 31.17,50.23 35.37,47.58 37.82,50.53 39.72,47.48 41.52,50.53 48.27,50.53 44.27,47.78 48.22,47.83 51.42,50.58 54.57,50.58 57.67,50.43 60.42,50.43 60.47,47.93 57.67,47.93 54.57,47.93 51.47,47.93 42.42,43.23 24.96,54.86 41.28,55.9 29.11,17.83 22.36,17.83 15.86,17.83 2.11,17.83 1.86,35.08 15.86,35.08 25.61,35.08 35.86,36.33 39.61,38.08 63.36,40.08 67.36,37.83 80.11,40.08 74.36,38.33 61.86,34.58 63.21,56.62 1.96,39.37 5.96,35.12 35.86,29.33 26.11,29.58 16.11,29.83 5.86,29.58 46.11,29.83 55.86,29.83 66.11,29.33 76.36,29.58 17.4,69.27
  pour Top: 0,86 82,86 82,0 0,0
  pour Bottom: 0,86 0,0 82,0 82,86
HV10
  Top 0.813: VALVE3.1 49.49,7.64 52.78,7.64 55.67,10.53 57.6,10.53 58.45,11.38 58.45,12.63 60.39,14.57 71.92,14.57 73.45,13.04 IC1.6
HV11
  Top 0.813: VALVE3.2 56.5,9.56 58.07,9.56 59.45,10.94 59.45,12.26 60.64,13.46 64.98,13.46 65.83,12.61 IC1.3
HV12
  Bottom 0.813: VALVE3.3 60.9,8.89 63.7,8.89 64.6,9.79 64.6,14.86 65.83,16.09 IC1.14
HV13
  Bottom 0.813: VALVE3.4 65.12,8.02 70.47,8.02 72.21,9.76 72.21,15.26 73.45,16.5 IC1.11
LLED  (via drill 0.35)
  Top 0.508: U1.7 28.97,79.71 31.1,79.71 31.1,79.1 | 31.1,79.1 31.1,78.5 31.04,78.43 31,78.48 U1.6 | R6.1 4.7,42.84 v4.63,42.9 | v32.05,79.1 31.1,79.1
  Bottom 0.508: v4.63,42.9 8.23,46.5 19.05,46.5 21.75,49.2 21.75,61 22.95,62.2 22.95,73.35 28.7,79.1 v32.05,79.1
N$1
  Bottom 0.813: VALVE_PWR.3 79.44,4.29 D3.A
N$2
  Top 0.508: C1.2 28.45,69.16 Q1.2 24.11,69.16 22.91,67.96 R8.2 19.74,67.96 19.04,67.26 17.17,67.26 U$1.8
N$3
  Top 0.508: C2.2 28.77,64.08 Q1.1 23.85,64.08 22.86,65.07 R8.1 19.77,65.07 18.87,65.97 18.12,65.97 17.24,65.97 17.19,65.97 U$1.7
N$5
  Top 0.508: AT-MEGA328P-PU.9 46.48,41.23 R11.1 | R11.1 43.32,41.07 C3.1 | R11.1 46.32,38.39 Q2.1
N$6
  Top 0.508: AT-MEGA328P-PU.10 49.02,41.26 R11.2 | R11.2 52.35,41.07 C4.1 | R11.2 49.21,38.65 Q2.2
N$9
  Top 1.016: T3.G 4.04,12.22 R12.2
N$11
  Top 1.016: U6.6 8.16,24.54 5.3,21.68 R12.1
N$12
  Top 1.016: R13.1 15.11,21.11 18.49,24.49 U5.6
N$13
  Top 1.016: X2.2 72.12,75.95 71,74.83 D6.A D4.C
N$14
  Top 0.508: R2.2 22.57,72.59 R3.2 20.31,76.59 22.2,78.48 U1.3
N$15
  Top 1.27: D6.C 70.5,63.17 73.71,59.96 C15.+ | D5.C 77.25,59.79 C15.+ | L1.1 73.75,56.21 C15.+
N$16
  Top 0.508: RST.2 23.64,43.44 23.55,43.53 20.42,43.53 C5.2
N$17
  Bottom 1.016: T2.A 10.36,15.38 12.5,15.38 13.75,14.12 13.75,11 10.61,7.86 VALVE1.2
N$18  (via drill 0.35)
  Top 0.508: DR-EN.2 57.81,17.44 v58.75,16.5 78,16.5 78.53,17.03 IC1.9
  Bottom 0.508: v58.75,16.5 60.75,14.5 IC1.1
N$19
  Bottom 1.016: D2.A 77.61,67.33 75,64.72 75,59.75 76.25,58.5 76.25,48.75 | 76.25,48.75 L1.2 | C9.+ 68.41,47 72,47 73.75,48.75 76.25,48.75
N$20
  Bottom 1.016: T4.A 23.55,15.25 25.91,15.25 26.88,14.28 26.88,12.75 20.77,6.64 VALVE1.4
N$21
  Top 1.016: T4.G 24.16,12.22 R14.2
N$22
  Top 1.016: R14.1 28.61,21.11 30,22.5 37.25,22.5 38.59,23.84 U8.6
N$23
  Top 1.016: R15.1 22.36,21.11 24,22.75 27.38,22.75 28.69,24.07 U7.6
N$25
  Top 1.016: T2.G 10.81,12.22 R13.2
N$26
  Top 0.508: U5.1 18.49,35.19 R20.1
N$27
  Top 1.016: T5.G 17.61,12.22 R15.2
N$28
  Top 0.508: U6.1 8.34,35.09 R16.1
N$29
  Bottom 1.016: T5.A 17.13,15.38 19.38,15.38 20.38,14.38 20.38,11.75 15.69,7.07 VALVE1.3
N$30
  Top 0.508: R9.1 10.83,40.64 TX.A
N$31
  Top 0.508: U7.1 28.69,35.16 R17.2
N$32
  Top 0.508: U8.1 38.59,35.16 R18.2
N$33
  Bottom 1.016: T3.A 3.81,15.38 6,15.38 6.88,14.5 6.88,11.75 5.5,10.38 5.5,4.29 VALVE1.1
N$35
  Bottom 1.016: T6.A 29.93,15.25 32.5,15.25 33.25,14.5 33.25,12.5 29.12,8.38 27.75,8.38 25.88,6.5 25.88,4.31 VALVE2.1
N$36
  Top 1.016: T6.G 30.68,12.25 R19.2
N$37
  Top 1.016: R19.1 37.78,21.04 40,23.25 46.88,23.25 48.16,24.54 U10.6
N$38
  Top 1.016: R21.1 41.8,22.08 47.36,22.08 47.72,22.44 55.29,22.44 56.08,23.23 57.18,23.23 U9.6
N$40
  Top 1.016: T7.G 39.53,12.2 R21.2
N$41
  Bottom 1.016: T7.A 30.88,7.5 30.88,4.3 VALVE2.2
N$42
  Bottom 1.016: T8.A 47.33,8.25 42.75,8.25 41.07,6.57 VALVE2.4
N$43
  Top 1.016: T8.G 56.23,12.25 R22.2
N$44
  Top 1.016: R22.1 57.2,20.84 73.08,20.84 74.62,22.38 77.88,22.38 78.79,23.29 U12.6
N$45
  Top 1.016: R23.1 55.53,21.04 56.56,22.06 67.69,22.06 68.59,22.96 U11.6
N$46
  Top 1.016: T9.G 47.26,12.3 R23.2
N$47
  Bottom 1.016: T9.A 38.41,7.62 37.12,7.62 35.99,6.49 VALVE2.3
N$48
  Top 0.508: U9.1 58.49,34.94 R24.1
N$49
  Top 0.508: U10.1 48.54,33.54 50.03,35.03 R25.1
N$50
  Top 0.508: U11.1 68.59,35.2 R26.2
N$51
  Top 0.508: R10.1 9.33,38.43 9.8,38.9 11.07,38.9 RX.A
N$52
  Top 0.508: U12.1 R27.2
N$54
  Top 0.508: C6.1 43.88,53.05 AT-MEGA328P-PU.21
P13LED
  Top 0.508: R6.2 10.99,42.84 L.A
PWRLED
  Top 0.508: R7.2 10.93,45.01 ON.A
RST  (via drill 0.35)
  Top 0.508: AT-MEGA328P-PU.1 26.22,45.3 26.22,41.97 25.25,41 23.69,41 RST.1 23.64,38.9 R1.1 | v47.76,56.7 47.76,57.29 v49,58.53
  Bottom 0.508: AT-MEGA328P-PU.1 26.16,47.3 27.79,48.93 33.17,48.93 35.09,50.86 35.09,54.27 38.32,57.49 46.97,57.49 v47.76,56.7 | v49,58.53 49.35,58.53 51.56,60.74 55.32,60.74 56.06,61.48 ICSP.5
SCL
  Top 0.508: AT-MEGA328P-PU.28 26.16,54.78 28.07,56.69 31.65,56.69 35.97,61 35.97,67.45 37.72,69.2 40.56,69.2 41.39,68.37 41.39,68.18 LCD.4
SDA
  Top 0.508: AT-MEGA328P-PU.27 28.7,54.58 30.15,56.03 31.92,56.03 36.88,60.99 36.88,67.39 37.38,67.89 LCD.2
UART-RX  (via drill 0.35)
  Top 0.508: UART.1 46.8,76.68 40.03,69.91 37.39,69.91 35.22,67.73 35.22,61.19 34.12,60.09 R5.2 32.59,59.9 32.59,59.14 31.13,57.68 26.26,57.68 23.41,54.83 23.41,48.52 24.18,47.75 28,47.75 28.7,47.05 AT-MEGA328P-PU.2 28.73,45.33 TEST.1 | RX.C 14.75,39 v21.8,39
  Bottom 0.508: v21.8,39 23.52,40.72 TEST.1
UART-TX  (via drill 0.35)
  Top 0.508: v22.71,49.3 22.74,49.32 22.74,55.19 25.94,58.38 30.27,58.38 31.13,59.24 31.13,61.4 32.08,62.34 R4.2 33.73,62.34 34.49,63.11 34.49,68.07 37.01,70.58 39.09,70.58 41.72,73.21 UART.2 | v24.68,48.78 29.72,48.78 31.25,47.25 AT-MEGA328P-PU.3 | AT-MEGA328P-PU.3 | TEST.2 31.27,45.34 AT-MEGA328P-PU.3 | TX.C 20.43,40.88 v21.5,41.95
  Bottom 0.508: v24.68,48.78 24.16,49.3 v22.71,49.3 22.71,43.16 v21.5,41.95
USB5V
  Top 1.27: F1.2 8.62,83.69 10.39,81.92 10.39,79.45 9.57,78.63 9.57,74.9 10.75,73.72 USB.1
USB-RX
  Top 0.508: U$1.3 27.94,60.95 29.41,62.42 29.84,62.42 R4.1
USB-TX
  Top 0.508: U$1.2 24.53,59.67 24.53,59.68 29.48,59.68 R5.1
V+  (via drill 0.35)
  Top 0.508: v69.75,78.25 69.75,82.5 67.81,84.44 40.54,84.44 31.85,75.75 29.75,75.75 29.5,75.5 v29.5,75.25 | v27,75 23.36,75 R3.1
  Top 1.016: PC1.+ 62.25,61.57 v62.25,65.25 62.25,71 60.5,72.75 52.75,72.75 v52,72 | C7.1 72,72.44 v72,72
  Bottom 0.508: v69.75,78.25 76.33,71.67 D2.C | v29.5,75.25 27.25,75.25 v27,75
  Bottom 1.016: D2.C 73.39,71.67 72,70.28 | 72,70.28 70.98,69.25 70.98,67.98 70.09,67.09 U2.3 66.59,67.09 64.75,65.25 v62.25,65.25 | v72,72 72,70.28 | v52,72 U3.3

### Text on the board
bPlace: TX | RX | A0 | A1 | +5V | GND | L | ~ | N | V2 | V3 | V4 | V5 | V6 | V7 | V8 | V9 | V10 | V11 | V12 | V13 | N | ~ | L | +9V